# EAGLE design MOTU_scaleup (EAGLE 7.4.0)
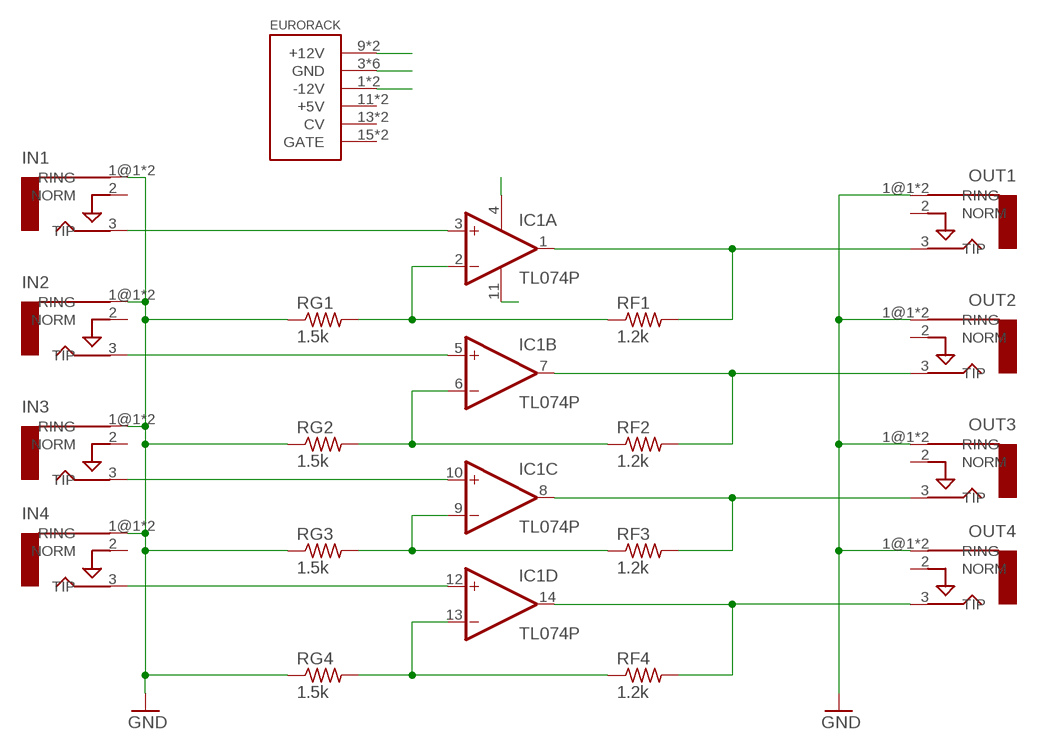
[diagram p0: schematic, sheet 1]

## Parts
EURORACK  POWER  [POWER_16]
IC1  TL074P  [DIL14]
IN1  AUDIO-JACKERTHENVAR  [ERTHENVAR-JACK]
IN2  AUDIO-JACKERTHENVAR  [ERTHENVAR-JACK]
IN3  AUDIO-JACKERTHENVAR  [ERTHENVAR-JACK]
IN4  AUDIO-JACKERTHENVAR  [ERTHENVAR-JACK]
OUT1  AUDIO-JACKERTHENVAR  [ERTHENVAR-JACK]
OUT2  AUDIO-JACKERTHENVAR  [ERTHENVAR-JACK]
OUT3  AUDIO-JACKERTHENVAR  [ERTHENVAR-JACK]
OUT4  AUDIO-JACKERTHENVAR  [ERTHENVAR-JACK]
RF1  1.2k  R-US_0207/10  [0207/10]
RF2  1.2k  R-US_0207/10  [0207/10]
RF3  1.2k  R-US_0207/10  [0207/10]
RF4  1.2k  R-US_0207/10  [0207/10]
RG1  1.5k  R-US_0207/10  [0207/10]
RG2  1.5k  R-US_0207/10  [0207/10]
RG3  1.5k  R-US_0207/10  [0207/10]
RG4  1.5k  R-US_0207/10  [0207/10]

## Nets
+12V: EURORACK.9(+12V) EURORACK.10(+12V) IC1.4(P:V+)
-12V: EURORACK.1(-12V) EURORACK.2(-12V) IC1.11(P:V-)
GND: EURORACK.3(GND) EURORACK.4(GND) EURORACK.5(GND) EURORACK.6(GND) EURORACK.7(GND) EURORACK.8(GND) IN1.1@1(RING) IN1.1@2(RING) IN2.1@1(RING) IN2.1@2(RING) IN3.1@1(RING) IN3.1@2(RING) IN4.1@1(RING) IN4.1@2(RING) OUT1.1@1(RING) OUT1.1@2(RING) OUT2.1@1(RING) OUT2.1@2(RING) OUT3.1@1(RING) OUT3.1@2(RING) OUT4.1@1(RING) OUT4.1@2(RING) RG1.1 RG2.1 RG3.1 RG4.1
N$1: IC1.3(A:+IN) IN1.3(TIP)
N$2: IC1.5(B:+IN) IN2.3(TIP)
N$3: IC1.10(C:+IN) IN3.3(TIP)
N$4: IC1.12(D:+IN) IN4.3(TIP)
N$5: IC1.14(D:OUT) OUT4.3(TIP) RF4.2
N$6: IC1.8(C:OUT) OUT3.3(TIP) RF3.2
N$7: IC1.7(B:OUT) OUT2.3(TIP) RF2.2
N$8: IC1.1(A:OUT) OUT1.3(TIP) RF1.2
N$10: IC1.6(B:-IN) RF2.1 RG2.2
N$11: IC1.9(C:-IN) RF3.1 RG3.2
N$12: IC1.13(D:-IN) RF4.1 RG4.2
NNN: IC1.2(A:-IN) RF1.1 RG1.2
Unconnected: EURORACK.11(+5V) EURORACK.12(+5V) EURORACK.13(CV) EURORACK.14(CV) EURORACK.15(GATE) EURORACK.16(GATE) IN1.2(NORM) IN2.2(NORM) IN3.2(NORM) IN4.2(NORM) OUT1.2(NORM) OUT2.2(NORM) OUT3.2(NORM) OUT4.2(NORM)

## Library data of the parts
EURORACK = eurorack:POWER
IC1 = linear:TL074: OP AMP
IN1-IN4 OUT1-OUT4 = erthenvar:AUDIO-JACK: Switching Mono 3.5mm Audio Jack from Erthenvar.
RF1-RF4 RG1-RG4 = resistor:R-US_: RESISTOR, American symbol

## Board
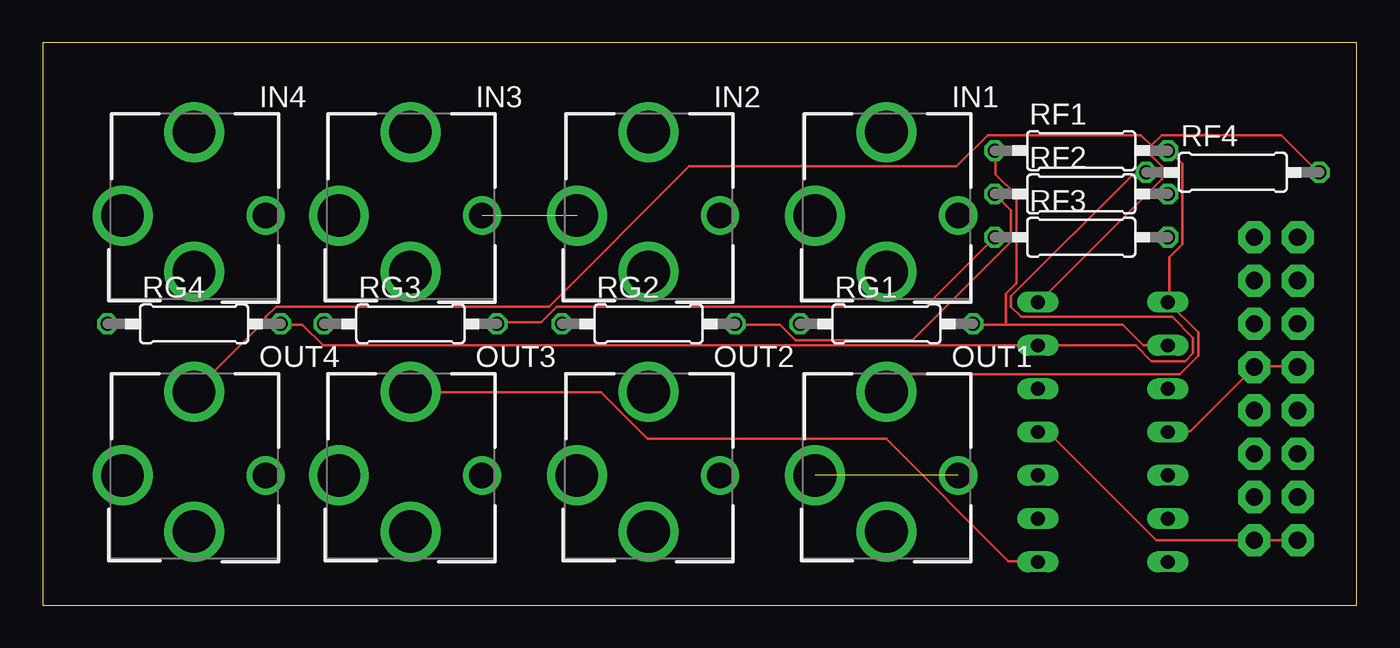
[diagram p1: board, top side]
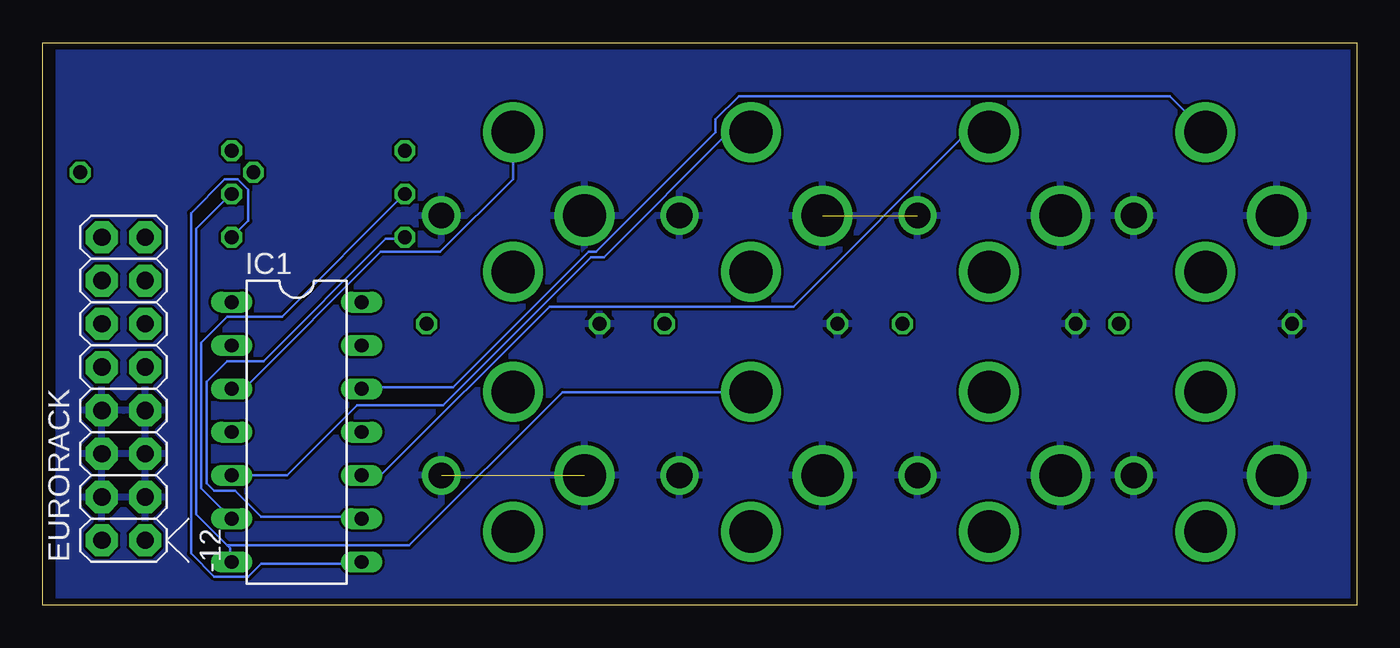
[diagram p2: board, bottom side, seen from below]

Size 77.14 x 33.01 mm. Coordinates in mm from the lower left corner, seen from the top.
Outline: 0,0 77.14,0 77.14,33.01 0,33.01 0,0
Copper layers (1*16): Top 0.0356mm / dielectric 1.5011mm / Bottom 0.0356mm
Design rules "LaenPCBOrder": minimum track width 6mil, minimum drill 13mil, track to track 6mil, track to pad 6mil, pad to pad 6mil, via to via 6mil, smd to smd 6mil, copper to edge 15mil, drill to drill 6mil, minimum pad ring 7mil, minimum via ring 7mil, stop-mask expansion 3mil, vias tented up to drill 0mil, thermal gap 10mil

### Footprints (pad centres in the part's own frame; a part is rotated, then mirrored left to right if it is on the bottom)
POWER_16 = drill 1.016 pad 1.88 octagon: 1 -6.35,-1.27; 2 -6.35,1.27; 3 -3.81,-1.27; 4 -3.81,1.27; 5 -1.27,-1.27; 6 -1.27,1.27; 7 1.27,-1.27; 8 1.27,1.27; 9 3.81,-1.27; 10 3.81,1.27; 11 6.35,-1.27; 12 6.35,1.27; 13 8.89,-1.27; 14 8.89,1.27; 15 11.43,-1.27; 16 11.43,1.27
DIL14 = drill 0.813 long: 1 -7.62,-3.81; 2 -5.08,-3.81; 3 -2.54,-3.81; 4 0,-3.81; 5 2.54,-3.81; 6 5.08,-3.81; 7 7.62,-3.81; 8 7.62,3.81; 9 5.08,3.81; 10 2.54,3.81; 11 0,3.81; 12 -2.54,3.81; 13 -5.08,3.81; 14 -7.62,3.81
ERTHENVAR-JACK = drill 2.5: 1@1 -4.2,0; 2 0,-3.3; 3 0,4.9 | drill 1.5: 1@2 4.2,0
0207/10 = drill 0.813 octagon: 1 -5.08,0; 2 5.08,0

### Placement (x,y rotation side)
EURORACK  72.39,10.16 90 bottom
IC1  62.23,10.16 270 bottom
IN1  49.53,22.86 0 top
IN2  35.56,22.86 0 top
IN3  21.59,22.86 0 top
IN4  8.89,22.86 0 top
OUT1  49.53,7.62 0 top
OUT2  35.56,7.62 0 top
OUT3  21.59,7.62 0 top
OUT4  8.89,7.62 0 top
RF1  60.96,26.67 0 top
RF2  60.96,24.13 0 top
RF3  60.96,21.59 0 top
RF4  69.85,25.4 0 top
RG1  49.53,16.51 0 top
RG2  35.56,16.51 0 top
RG3  21.59,16.51 0 top
RG4  8.89,16.51 0 top

### Tracks (layer width: path | path; a pad name or v marks a point on that pad's centre or on a via)
+12V
  Top 0.152: IC1.4 66.14,10.21 67.36,10.21 EURORACK.9 71.17,14.02 73.61,14.02 EURORACK.10
-12V
  Top 0.152: IC1.11 58.52,10.06 59.13,10.06 65.38,3.81 EURORACK.1 EURORACK.2
GND  (2 unrouted)
  pour Bottom: 1.27,33.02 76.2,33.02 76.2,0 0,0 0,33.02
N$1
  Bottom 0.152: IN1.3 49.53,24.99 53.8,20.73 57.3,20.73 65.23,12.8 65.99,12.8 IC1.3
N$2
  Bottom 0.152: IC1.5 62.79,7.62 58.67,11.73 53.65,11.73 44.96,20.42 44.2,20.42 36.88,27.74 35.66,27.74 IN2.3
N$3
  Bottom 0.152: IC1.10 57.3,7.62 47.4,17.53 33.07,17.53 22.86,27.74 21.64,27.74 IN3.3
N$4
  Bottom 0.152: IC1.12 58.37,12.8 53.03,12.8 45.11,20.73 44.65,20.73 37.64,27.74 37.64,28.5 36.27,29.87 10.97,29.87 8.99,27.89 IN4.3
N$5
  Top 0.152: 65.08,26.98 65.08,26.36 65.68,25.76 65.68,24.99 58.52,17.83 IC1.14 | 65.08,26.98 65.68,27.58 72.69,27.58 74.83,25.45 RF4.2 | 65.08,26.98 64.47,27.58 55.47,27.58 53.65,25.76 37.95,25.76 29.72,17.53 13.72,17.53 13.11,16.92 13.11,16.76 8.99,12.65 OUT4.3
N$6
  Top 0.152: OUT3.3 21.64,12.5 32.77,12.5 35.51,9.75 49.53,9.75 56.69,2.59 58.37,2.59 IC1.8
  Bottom 0.152: RF3.2 65.08,22.55 65.08,24.38 65.68,24.99 66.45,24.99 68.43,23.01 68.43,3.05 67.06,1.68 65.08,1.68 64.31,2.44 58.52,2.44 IC1.8
N$7
  Bottom 0.152: 66.29,3.5 68.12,5.33 68.12,22.1 66.14,24.08 RF2.2 | 66.29,3.5 66.14,3.35 66.14,2.59 IC1.7 | 66.29,3.5 55.63,3.5 46.63,12.5 35.66,12.5 OUT2.3
N$8
  Top 0.152: RF1.2 66.14,26.67 66.9,25.91 66.9,21.18 66.14,20.42 66.14,17.83 IC1.1 67.82,16 67.82,14.63 66.75,13.56 50.44,13.56 49.53,12.65 OUT1.3
N$10
  Top 0.152: RF2.1 56.84,23.16 56.84,21.34 51.05,15.54 44.2,15.54 43.28,16.46 40.69,16.46 RG2.2
  Bottom 0.152: IC1.6 67.82,6.86 67.82,15.39 66.29,16.92 63.09,16.92 RF2.1
N$11
  Top 0.152: RF3.1 51.82,17.53 30.18,17.53 29.26,16.61 26.67,16.61 RG3.2
  Bottom 0.152: IC1.9 58.52,5.18 64.31,5.18 65.84,6.71 67.06,6.71 67.51,7.16 67.51,13.11 66.29,14.33 64.16,14.33 57,21.49 55.93,21.49 RF3.1
N$12
  Top 0.152: RF4.1 64.77,25.3 64.01,25.3 56.84,18.14 56.84,17.53 57.45,16.92 66.29,16.92 67.51,15.7 67.51,14.78 67.06,14.33 65.08,14.33 64.16,15.24 IC1.13 16.46,15.24 15.24,16.46 14.02,16.46 RG4.2
NNN
  Top 0.152: IC1.2 64.62,15.24 63.4,16.46 56.54,16.46 | 56.54,16.46 54.71,16.46 RG1.2 | 56.54,16.46 56.54,18.29 57.15,18.9 57.15,24.08 55.93,25.3 55.93,26.67 RF1.1